# EAGLE design Main Board v3 Quad MD (EAGLE 9.6.2)

## Sheet 1 of 2: High Power
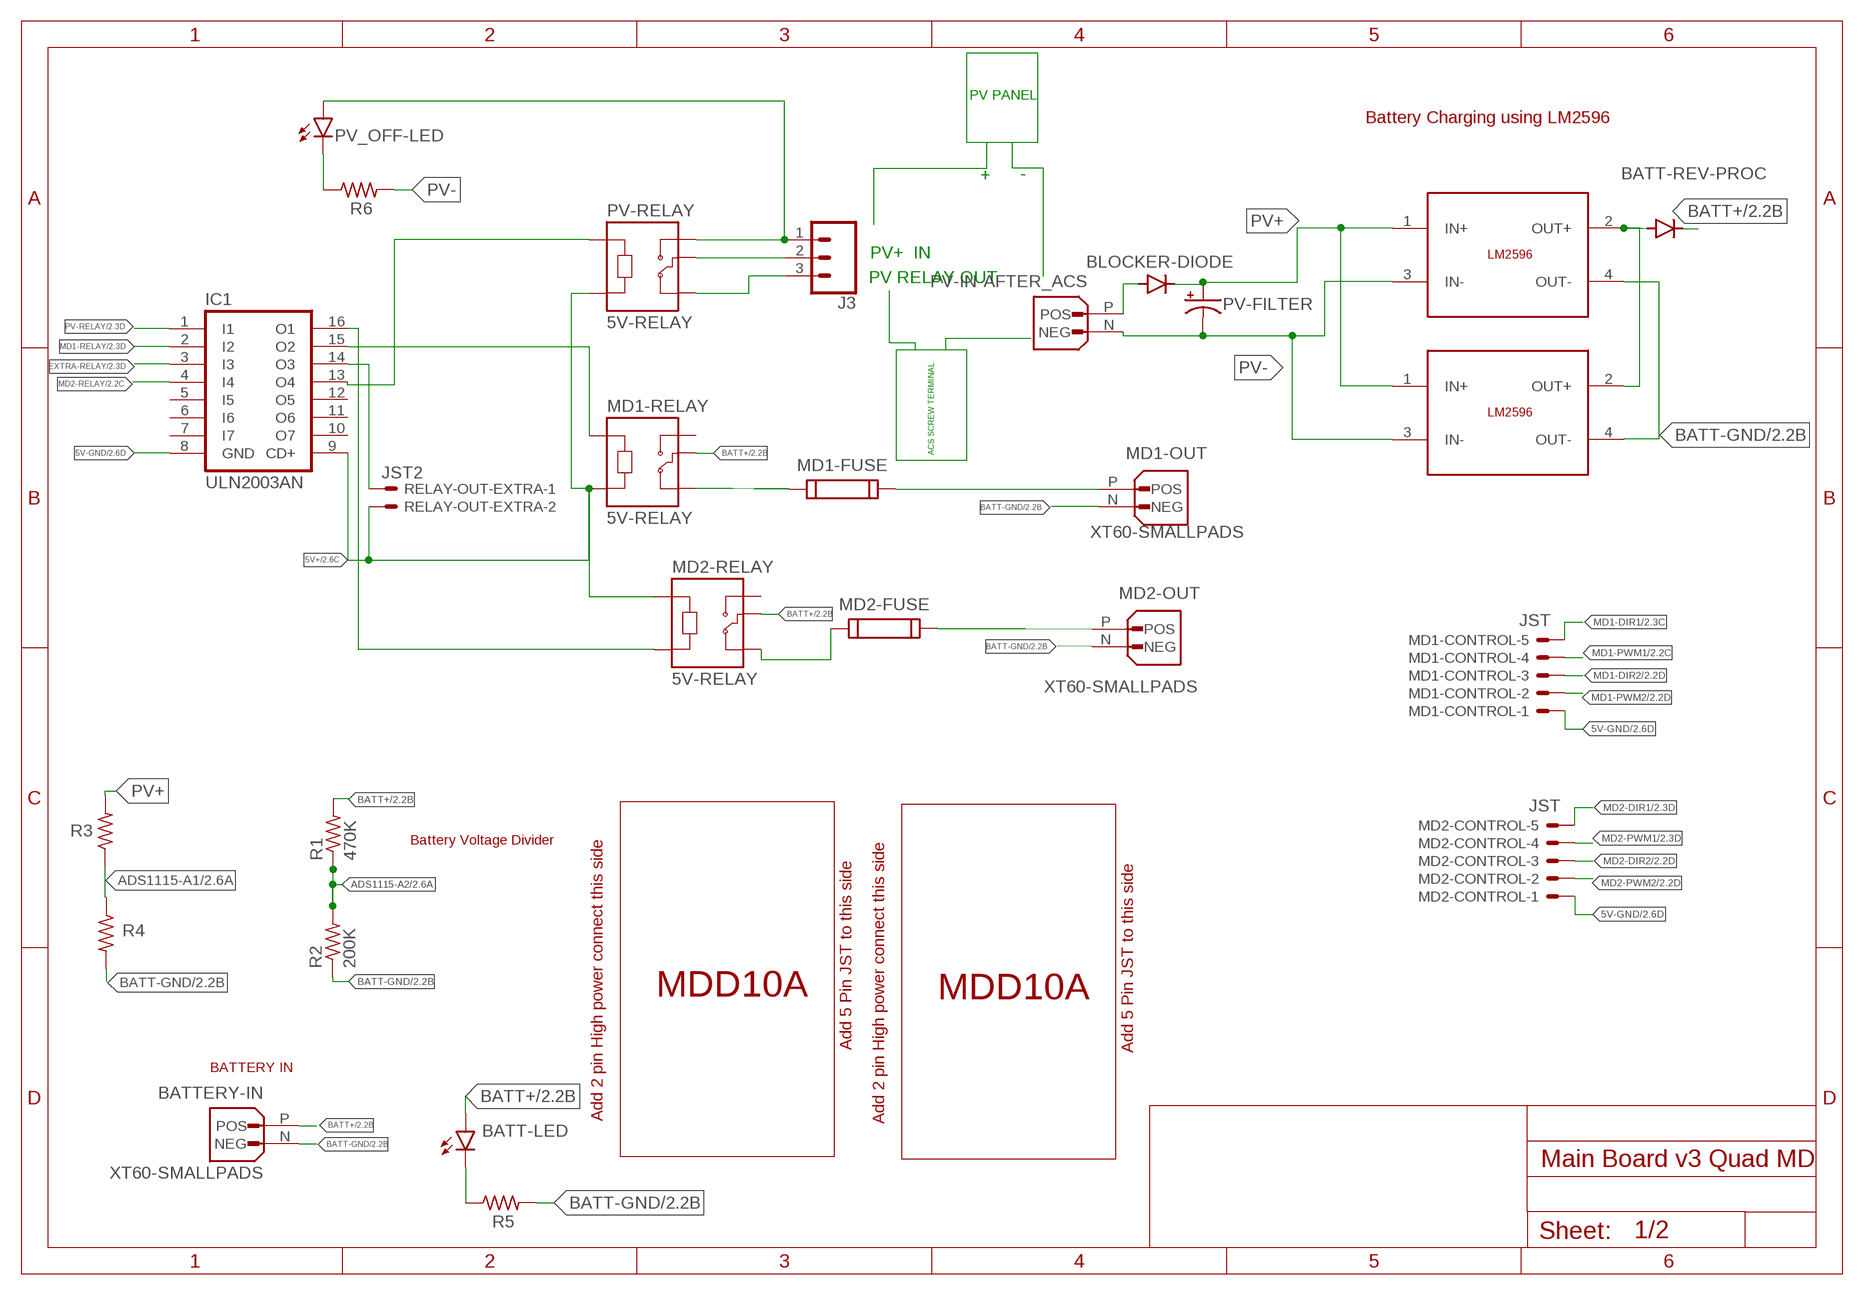
[diagram p0: schematic, sheet 1]

### Parts
BATT-LED  SFH482  [SFH482]
BATT-REV-PROC  1N5400  [DO201-15]
BATTERY-IN  XT60-SMALLPADS  [XT-60-SMALLPADS]
BLOCKER-DIODE  1N5400  [DO201-15]
IC1  ULN2003AN  [DIL16]
J3  CONN_03SCREW_LOCK  [SCREWTERMINAL-3.5MM-3_LOCK.007S]
MD1-CONTROL  JST  JST-XH-05-PIN-LONG-PAD  [JST-XH-05-PACKAGE-LONG-PAD]
MD1-FUSE  696101000002  [696101000002]
MD1-OUT  XT60-SMALLPADS  [XT-60-SMALLPADS]
MD1-RELAY  5V-RELAY  [RELAY-SRD-05VDC-SL-C]
MD2-CONTROL  JST  JST-XH-05-PIN-LONG-PAD  [JST-XH-05-PACKAGE-LONG-PAD]
MD2-FUSE  696101000002  [696101000002]
MD2-OUT  XT60-SMALLPADS  [XT-60-SMALLPADS]
MD2-RELAY  5V-RELAY  [RELAY-SRD-05VDC-SL-C]
PV-FILTER  CPOL-USE5-6  [E5-6]
PV-IN-AFTER_ACS  XT60-SMALLPADS  [XT-60-SMALLPADS]
PV-RELAY  5V-RELAY  [RELAY-SRD-05VDC-SL-C]
PV_OFF-LED  SFH482  [SFH482]
R1  470K  R-US_0309/12  [0309/12]
R2  200K  R-US_0309/12  [0309/12]
R3  R-US_0309/12  [0309/12]
R4  R-US_0309/12  [0309/12]
R5  R-US_0309/12  [0309/12]
R6  R-US_0309/12  [0309/12]
RELAY-OUT-EXTRA  JST2  JST-XH-02-PIN-LONG-PAD  [JST-XH-02-PACKAGE-LONG-PAD]
U$1  LM2596-MODULE  [LM2596-MODULE]
U$2  LM2596-MODULE  [LM2596-MODULE]
U$3  MDD10A-MODULE  [MDD10A]
U$7  MDD10A-MODULE  [MDD10A]

### Nets
5V+: IC1.9(CD+) MD1-RELAY.A2 MD2-RELAY.A1 PV-RELAY.A2 RELAY-OUT-EXTRA.2 ; also sheet 2
5V-GND: IC1.8(GND) MD1-CONTROL.1 MD2-CONTROL.1 ; also sheet 2
ADS1115-A1: R3.1 R4.1 ; also sheet 2
ADS1115-A2: R1.1 R2.2 ; also sheet 2
BATT+: BATT-LED.A BATT-REV-PROC.C BATTERY-IN.P(POS) MD1-RELAY.COM MD2-RELAY.COM R1.2 ; also sheet 2
BATT-GND: BATTERY-IN.N(NEG) MD1-OUT.N(NEG) MD2-OUT.N(NEG) R2.1 R4.2 R5.2 U$1.4(OUT-) U$2.4(OUT-) ; also sheet 2
EXTRA-RELAY: IC1.3(I3) ; also sheet 2
MD1-DIR1: MD1-CONTROL.5 ; also sheet 2
MD1-DIR2: MD1-CONTROL.3 ; also sheet 2
MD1-PWM1: MD1-CONTROL.4 ; also sheet 2
MD1-PWM2: MD1-CONTROL.2 ; also sheet 2
MD1-RELAY: IC1.2(I2) ; also sheet 2
MD2-DIR1: MD2-CONTROL.5 ; also sheet 2
MD2-DIR2: MD2-CONTROL.3 ; also sheet 2
MD2-PWM1: MD2-CONTROL.4 ; also sheet 2
MD2-PWM2: MD2-CONTROL.2 ; also sheet 2
MD2-RELAY: IC1.4(I4) ; also sheet 2
N$1: MD1-FUSE.2 MD1-OUT.P(POS)
N$2: IC1.14(O3) RELAY-OUT-EXTRA.1
N$3: J3.1 PV-RELAY.NO PV_OFF-LED.A
N$4: J3.2 PV-RELAY.COM
N$5: MD1-FUSE.1 MD1-RELAY.NC
N$6: MD2-FUSE.1 MD2-RELAY.NC
N$13: BLOCKER-DIODE.A PV-IN-AFTER_ACS.P(POS)
N$14: IC1.16(O1) MD2-RELAY.A2
N$15: MD2-FUSE.2 MD2-OUT.P(POS)
N$16: BATT-REV-PROC.A U$1.2(OUT+) U$2.2(OUT+)
N$17: IC1.13(O4) PV-RELAY.A1
N$18: BATT-LED.K(C) R5.1
N$19: PV_OFF-LED.K(C) R6.1
N$23: J3.3 PV-RELAY.NC
N$85: IC1.15(O2) MD1-RELAY.A1
PV+: BLOCKER-DIODE.C PV-FILTER.+ R3.2 U$1.1(IN+) U$2.1(IN+)
PV-: PV-FILTER.- PV-IN-AFTER_ACS.N(NEG) R6.2 U$1.3(IN-) U$2.3(IN-)
PV-RELAY: IC1.1(I1) ; also sheet 2
Unconnected: IC1.5(I5) IC1.6(I6) IC1.7(I7) IC1.10(O7) IC1.11(O6) IC1.12(O5) MD1-RELAY.NO MD2-RELAY.NO

### Notes on the sheet
- PV PANEL
- Battery Charging using LM2596
- + | -
- PV+  IN
- PV RELAY OUT
- ACS SCREW TERMINAL
- Battery Voltage Divider
- BATTERY IN

## Sheet 2 of 2: Embedded Systems
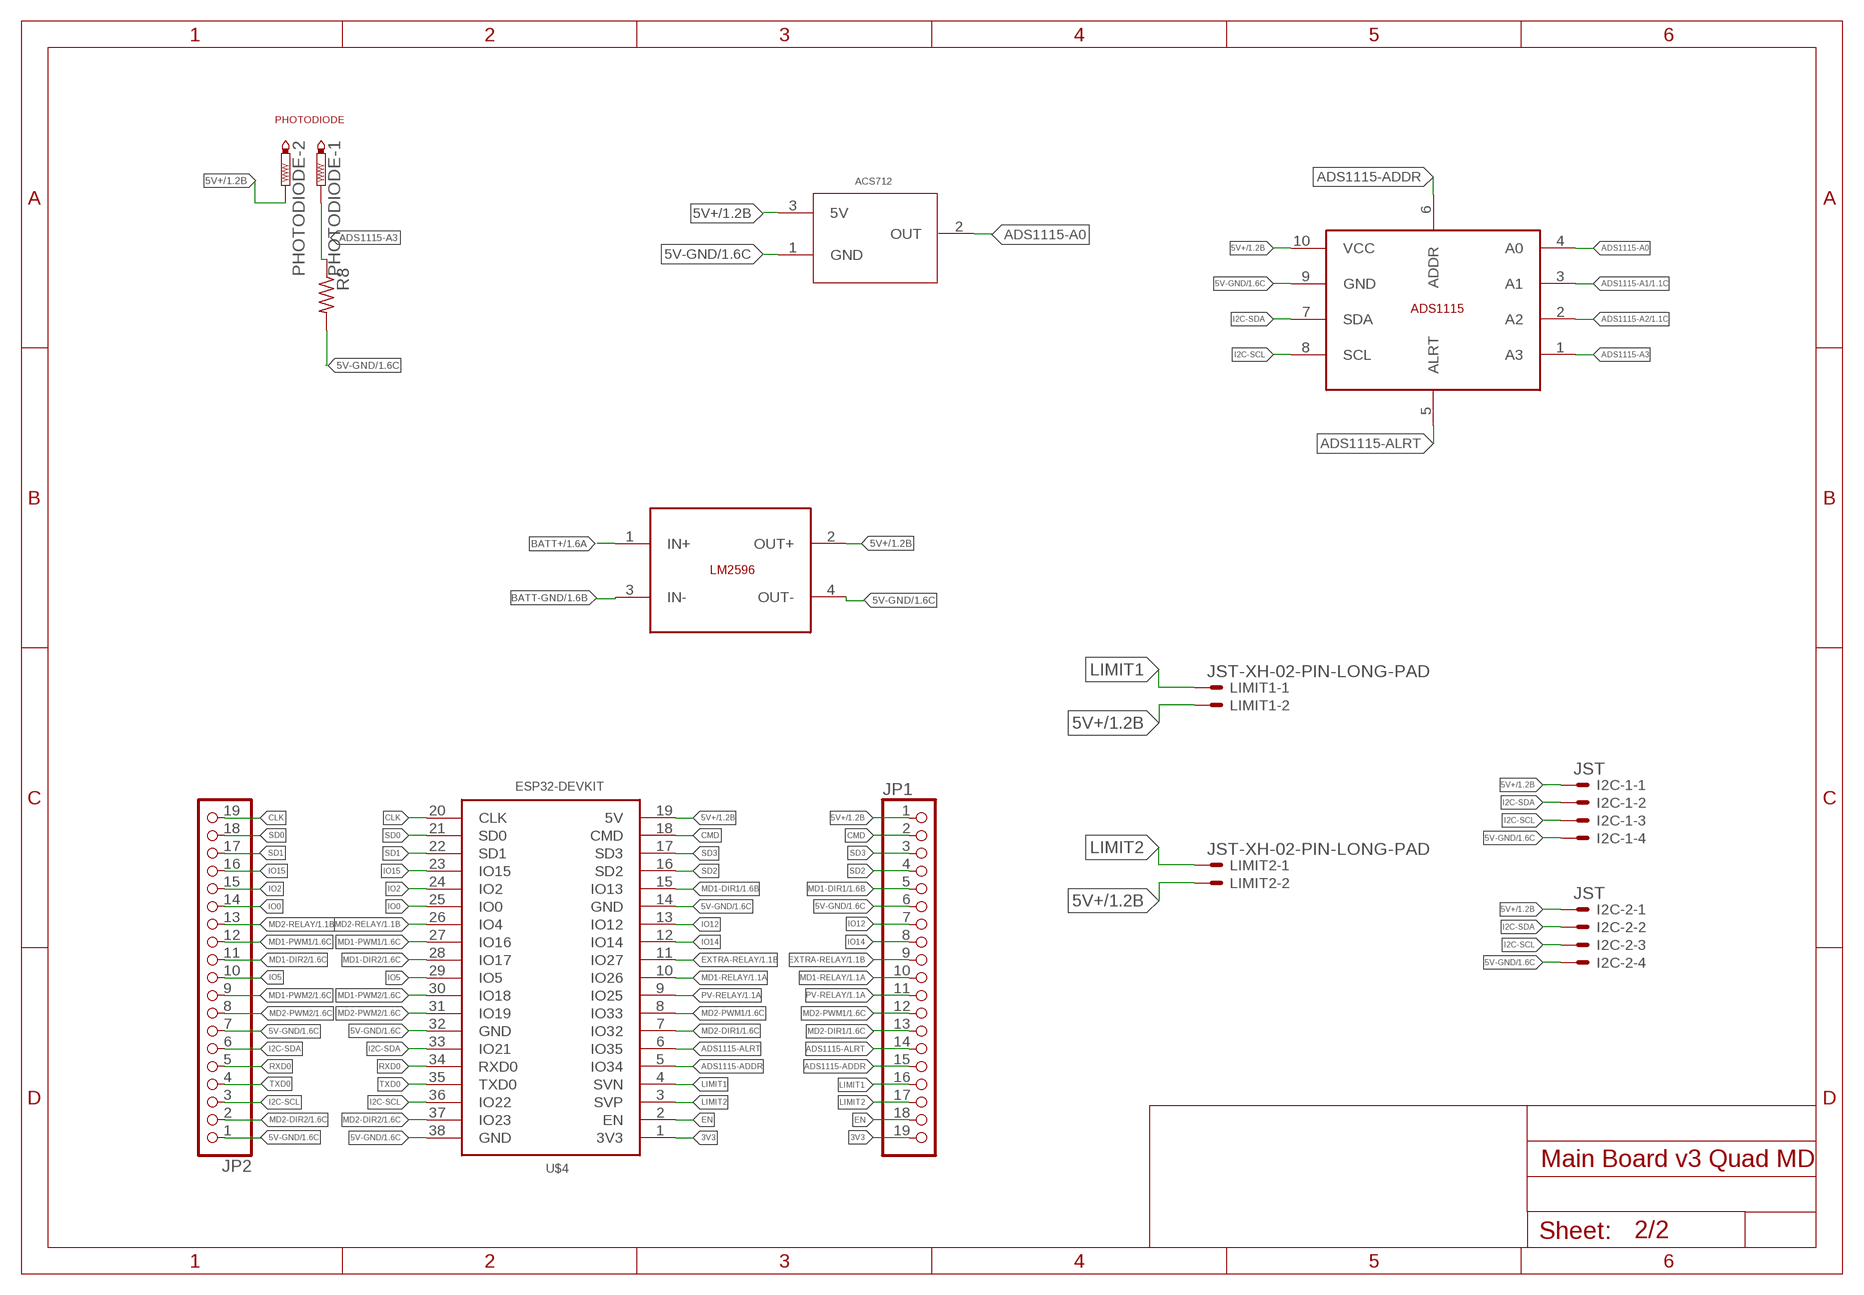
[diagram p1: schematic, sheet 2]

### Parts
I2C-1  JST  JST-XH-04-PIN-LONG-PAD  [JST-XH-04-PACKAGE-LONG-PAD]
I2C-2  JST  JST-XH-04-PIN-LONG-PAD  [JST-XH-04-PACKAGE-LONG-PAD]
JP1  PINHD-1X19  [1X19]
JP2  PINHD-1X19  [1X19]
LIMIT1  JST-XH-02-PIN-LONG-PAD  [JST-XH-02-PACKAGE-LONG-PAD]
LIMIT2  JST-XH-02-PIN-LONG-PAD  [JST-XH-02-PACKAGE-LONG-PAD]
PHOTODIODE  PTR2  [P2-38-17]
R8  R-US_0309/12  [0309/12]
U$4  ESP32-DEVKIT  [ESP32-38PINS]
U$5  ACS712-MODULE  [ACS712-MODULE]
U$6  ADS1115-MODULE  [ADS1115-MODULE]
U$8  LM2596-MODULE  [LM2596-MODULE]

### Nets
3V3: JP1.19 U$4.1(3V3)
5V+: I2C-1.1 I2C-2.1 JP1.1 LIMIT1.2 LIMIT2.2 PHOTODIODE.TP-2 U$4.19(5V) U$5.3(5V) U$6.10(VCC) U$8.2(OUT+) ; also sheet 1
5V-GND: I2C-1.4 I2C-2.4 JP1.6 JP2.1 JP2.7 R8.2 U$4.14(GND) U$4.32(GND) U$4.38(GND) U$5.1(GND) U$6.9(GND) U$8.4(OUT-) ; also sheet 1
ADS1115-A0: U$5.2(OUT) U$6.4(A0)
ADS1115-A1: U$6.3(A1) ; also sheet 1
ADS1115-A2: U$6.2(A2) ; also sheet 1
ADS1115-A3: PHOTODIODE.TP-1 R8.1 U$6.1(A3)
ADS1115-ADDR: JP1.15 U$4.5(IO34) U$6.6(ADDR)
ADS1115-ALRT: JP1.14 U$4.6(IO35) U$6.5(ALRT)
BATT+: U$8.1(IN+) ; also sheet 1
BATT-GND: U$8.3(IN-) ; also sheet 1
CLK: JP2.19 U$4.20(CLK)
CMD: JP1.2 U$4.18(CMD)
EN: JP1.18 U$4.2(EN)
EXTRA-RELAY: JP1.9 U$4.11(IO27) ; also sheet 1
I2C-SCL: I2C-1.3 I2C-2.3 JP2.3 U$4.36(IO22) U$6.8(SCL)
I2C-SDA: I2C-1.2 I2C-2.2 JP2.6 U$4.33(IO21) U$6.7(SDA)
IO0: JP2.14 U$4.25(IO0)
IO2: JP2.15 U$4.24(IO2)
IO5: JP2.10 U$4.29(IO5)
IO12: JP1.7 U$4.13(IO12)
IO14: JP1.8 U$4.12(IO14)
IO15: JP2.16 U$4.23(IO15)
LIMIT1: JP1.16 LIMIT1.1 U$4.4(SVN)
LIMIT2: JP1.17 LIMIT2.1 U$4.3(SVP)
MD1-DIR1: JP1.5 U$4.15(IO13) ; also sheet 1
MD1-DIR2: JP2.11 U$4.28(IO17) ; also sheet 1
MD1-PWM1: JP2.12 U$4.27(IO16) ; also sheet 1
MD1-PWM2: JP2.9 U$4.30(IO18) ; also sheet 1
MD1-RELAY: JP1.10 U$4.10(IO26) ; also sheet 1
MD2-DIR1: JP1.13 U$4.7(IO32) ; also sheet 1
MD2-DIR2: JP2.2 U$4.37(IO23) ; also sheet 1
MD2-PWM1: JP1.12 U$4.8(IO33) ; also sheet 1
MD2-PWM2: JP2.8 U$4.31(IO19) ; also sheet 1
MD2-RELAY: JP2.13 U$4.26(IO4) ; also sheet 1
PV-RELAY: JP1.11 U$4.9(IO25) ; also sheet 1
RXD0: JP2.5 U$4.34(RXD0)
SD0: JP2.18 U$4.21(SD0)
SD1: JP2.17 U$4.22(SD1)
SD2: JP1.4 U$4.16(SD2)
SD3: JP1.3 U$4.17(SD3)
TXD0: JP2.4 U$4.35(TXD0)

### Notes on the sheet
- PHOTODIODE

## Library data of the parts
BATT-LED PV_OFF-LED = led:SFH482: IR LED infrared emitting diode, Infineon
BATT-REV-PROC BLOCKER-DIODE = diode:1N5400: DIODE standard rectifier, 3 A, 50 V (Motorola)
BATTERY-IN MD1-OUT MD2-OUT PV-IN-AFTER_ACS = XT60-M:XT60-SMALLPADS
I2C-1 I2C-2 = JST XH Connectors:JST-XH-04-PIN: JST XH Connector 2 Pin Wire to board connector. Pitch: 2,54 mm, (0.100") Number of pins: 4
IC1 = ULN2003A:ULN2003A: Darlington Array Check availability <https://pricing.snapeda.com/parts/ULN2003A/STMicroelectronics/view-part?ref=eda>; AVAILABILITY: In Stock; DESCRIPTION: DARLINGTON ARRAY 7NPN, 2003, DIP16; Transistor Polarity:NPN; Collector Emitter Voltage V(br)ceo:50V; DC Collector Current:500mA; DC Current Gain hFE:1000; Operating Temperature Range:-20°C to +85°C; Transistor Case Style:DIP; No. of Pins:16; SVHC:No SVHC (20-Jun-2011); Base Number:2003; Current Ic Continuous a Max:500mA; Device Marking:ULN2003A; IC Generic Number:2003; Input Type:TTL, CMOS 5V; Input Voltage Max:5V; Logic Function Number:2003; Module Configuration:Seven; No. of Channels:7; No. of Transistors:7; Operating Temperature Max:85°C; Operating Temperature Min:-20°C; Output Current Max:500mA; Output Type:Open Collector; Output Voltage Max:50V; Package / Case:DIP; Termination Type:Through Hole; Transistor Type:Power Darlington; MF: STMicroelectronics; MP: ULN2003A; PACKAGE: DIP-16 Sprague; PRICE: None; PURCHASE-URL: https://pricing.snapeda.com/search/part/ULN2003A/?ref=eda; SPICEPREFIX: X
J3 = SparkFun-Connectors:CONN_03: Multi connection point. Often used as Generic Header-pin footprint for 0.1 inch spaced/style header connections On any of the 0.1 inch spaced packages, you can populate with these: Break Away Headers - Straight <https://www.sparkfun.com/products/116> (PRT-00116) Break Away Male Headers - Right Angle <https://www.sparkfun.com/products/553> (PRT-00553) Female Headers <https://www.sparkfun.com/products/115> (PRT-00115) Break Away Headers - Machine Pin <https://www.sparkfun.com/products/117> (PRT-00117) Break Away Female Headers - Swiss Machine Pin <https://www.sparkfun.com/products/743> (PRT-00743) Stackable Header - 3 Pin (Female, 0.1") <https://www.sparkfun.com/products/13875> (PRT-13875) For SCREWTERMINALS and SPRING TERMINALS visit here: Screw Terimnals on SparkFun.com <https://www.sparkfun.com/search/results?term=Screw+Terminals> (5mm/3.5mm/2.54mm spacing) This device is also useful as a general connection point to wire up your design to another part of your project. Our various solder wires solder well into these plated through hole pads. Hook-Up Wire - Assortment (Stranded, 22 AWG) <https://www.sparkfun.com/products/11375> (PRT-11375) Hook-Up Wire - Assortment (Solid Core, 22 AWG) <https://www.sparkfun.com/products/11367> (PRT-11367) View the entire wire category on our website here <https://www.sparkfun.com/categories/141> Special notes: Molex polarized connector foot print use with SKU : PRT-08232 with associated crimp pins and housings.; PROD_ID: CONN-08288; SF_ID: PRT-08235
JP1 JP2 = pinhead:PINHD-1X19: PIN HEADER
LIMIT1 LIMIT2 RELAY-OUT-EXTRA = JST XH Connectors:JST-XH-02-PIN: JST XH Connector 2 Pin Wire to board connector. Pitch: 2,54 mm, (0.100") Number of pins: 2
MD1-CONTROL MD2-CONTROL = JST XH Connectors:JST-XH-05-PIN: JST XH Connector 2 Pin Wire to board connector. Pitch: 2,54 mm, (0.100") Number of pins: 5
MD1-FUSE MD2-FUSE = Wurth_Connectors_WR-FSH:696101000002: WR-FSH Fuseholder THT Blocks PCB Clip Cover MATERIAL PROPERTIES Insulator Material PPO (PPE+PS) Insulator Flammability Rating UL94 V-1 Insulator Color Beige Contact Material Copper Alloy Contact Plating Tin over Nickel Contact Type Stamped GENERAL INFORMATION Operating Temperature -30 up to +120 °C Compliance RoHS ELECTRICAL PROPERTIES IR UL 18 A IR VDE 6.3 A Working Voltage [UL] 250 V (AC) Working Voltage [VDE] 250 V (AC) Withstanding Voltage [UL] 1500 V (AC) Withstanding Voltage [VDE] 1500 V (AC) Contact Resistance 10 mΩ MECHANICAL PROPERTIES Protection Class I & II Fuse Size 5x20 mm CERTIFICATION cULus Approval E157417 VDE Approval 129300 PACKAGING PROPERTIES Packaging Box <https://katalog.we-online.com/media/images/v2/o33101v209%20Family_WR-FSH_696101000002.jpg> Details see: https://katalog.we-online.com/en/em/FSH_THT_PCB_CLIP_COVER_696101000002 Updated by Ella Wu 2019-10-25 2019 (C) Wurth Elektronik; DATASHEET-URL: https://www.we-online.com/catalog/datasheet/696101000002.pdf; IR-UL: 18A; IR-VDE: 6.3A; MATES: 696120004001; PART-NUMBER: 696101000002; VALUE: 696101000002
MD1-RELAY MD2-RELAY PV-RELAY = 5V Relay:5V-RELAY: SRD-05VDC-SL-C 5V Trigger Relay Module For Arduino And Raspberry Pi 5V Trigger Relay Module For Arduino And Raspberry Pi Check availability <https://pricing.snapeda.com/parts/SRD-05VDC-SL-C/Songle%20Relay/view-part?ref=eda> Dimensions : 19.1x15.1x15.3 mm (LxWxH); AVAILABILITY: Not in stock; DESCRIPTION: 5V Trigger Relay Module For Arduino And Raspberry Pi 5V Trigger Relay Module For Arduino And Raspberry Pi; MF: Songle Relay; MP: SRD-05VDC-SL-C; PACKAGE: NON STANDARD-5 Songle Relay; PRICE: None
PHOTODIODE = testpad:PTR2: TEST PIN
PV-FILTER = rcl:CPOL-US: POLARIZED CAPACITOR, American symbol; SPICEPREFIX: C
R1-R6 R8 = rcl:R-US_: RESISTOR, American symbol; SPICEPREFIX: R
U$1 U$2 U$8 = LM2596 Module:LM2596-MODULE
U$3 U$7 = MDD10A Module:MDD10A-MODULE: This device is to place a MDD10A module on the top/bottom of the PCB using standoff's. You are supposed to have JST/Equivalent connector to connect the MD to the PCB. Similarly you have to have a 2 large pads on the other side to power the MD.
U$4 = ESP32 Devkit:ESP32-DEVKIT: ESP32 Devkit 38 GPIO Pins Specifications: Single or Dual-Core 32-bit LX6 Microprocessor with clock frequency up to 240 MHz. 520 KB of SRAM, 448 KB of ROM and 16 KB of RTC SRAM. Supports 802.11 b/g/n Wi-Fi connectivity with speeds up to 150 Mbps. Support for both Classic Bluetooth v4.2 and BLE specifications. 34 Programmable GPIOs. Up to 18 channels of 12-bit SAR ADC and 2 channels of 8-bit DAC. Serial Connectivity include 4 x SPI, 2 x I2C, 2 x I2S, 3 x UART. Ethernet MAC for physical LAN Communication (requires external PHY). 1 Host controller for SD/SDIO/MMC and 1 Slave controller for SDIO/SPI. Motor PWM and up to 16-channels of LED PWM. Secure Boot and Flash Encryption. Cryptographic Hardware Acceleration for AES, Hash (SHA-2), RSA, ECC and RNG.
U$5 = ACS712 Module:ACS712-MODULE
U$6 = ADS1115 MODULE:ADS1115-MODULE

## Board
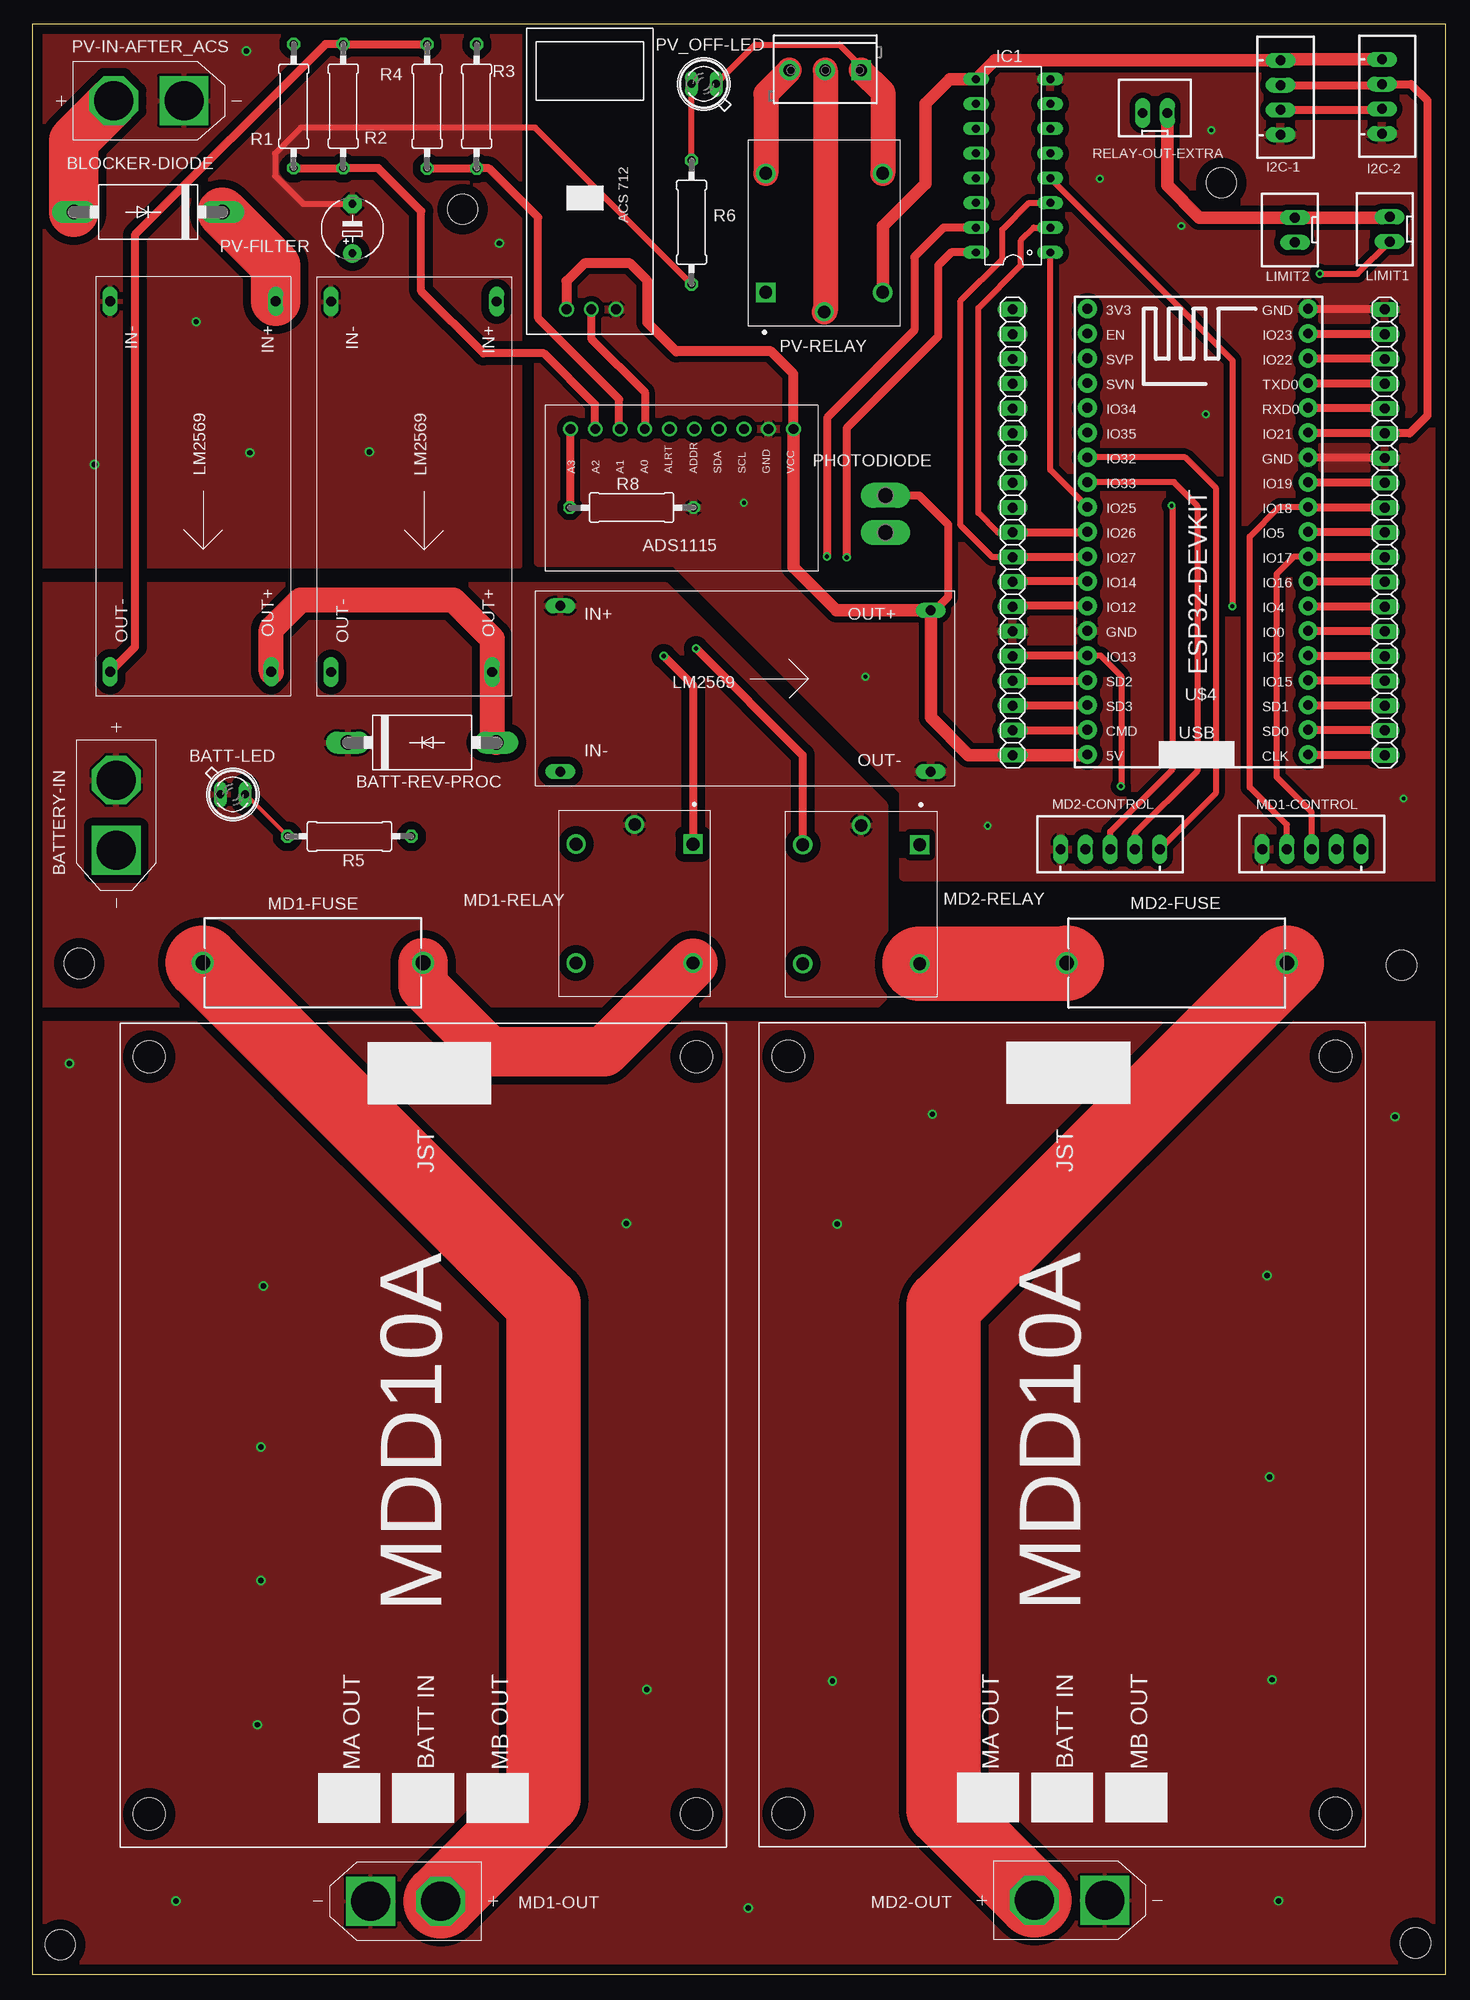
[diagram p2: board, top side]
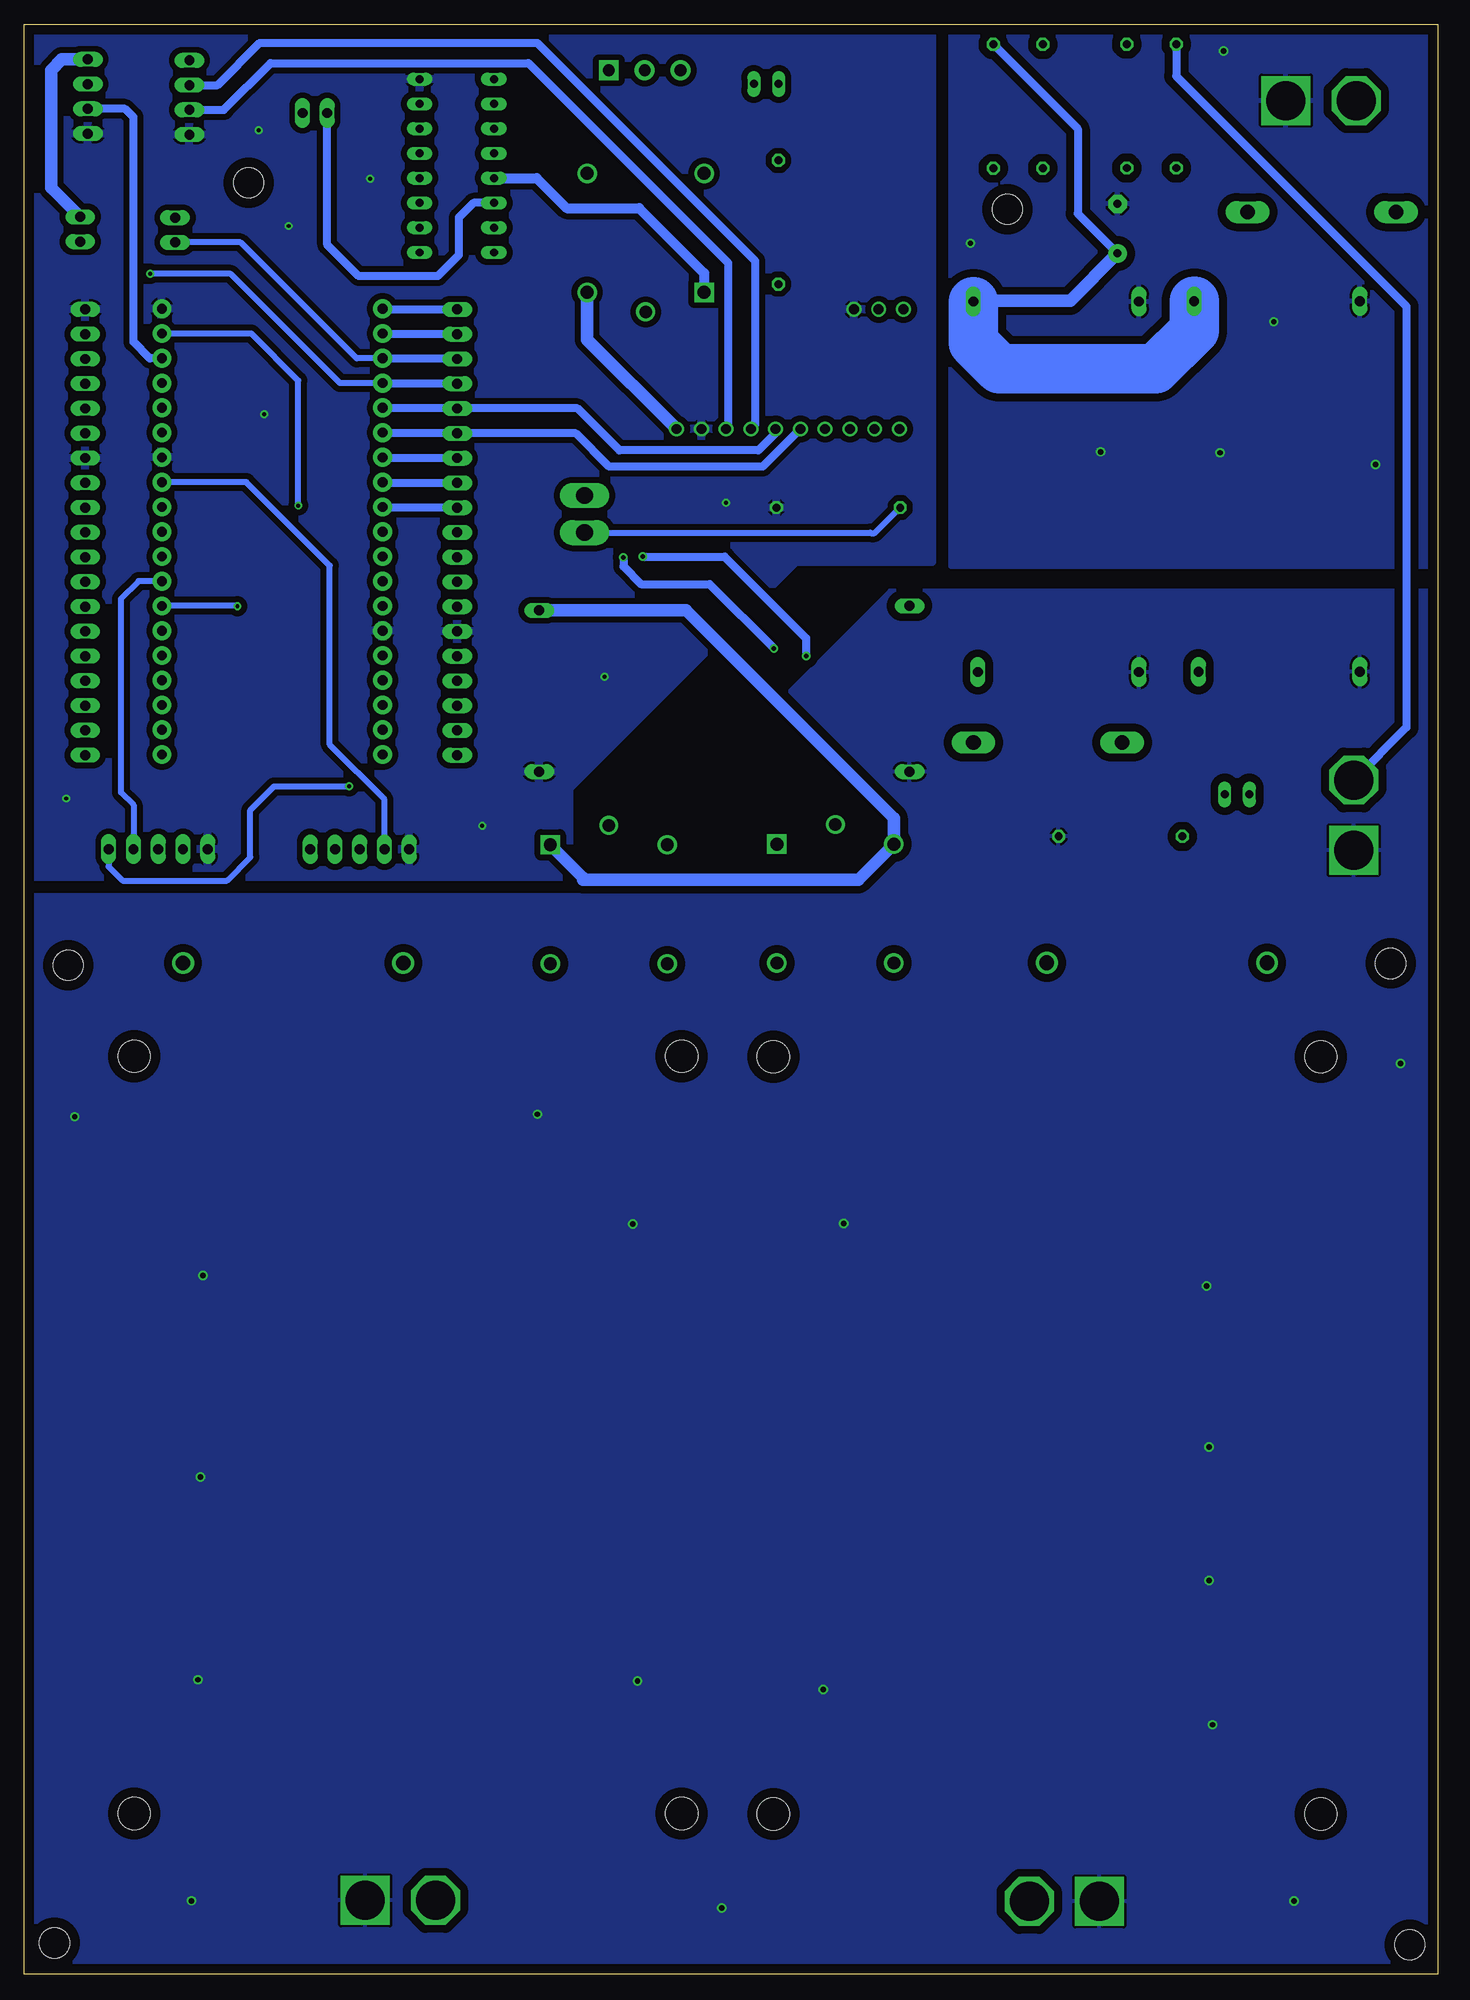
[diagram p3: board, bottom side, seen from below]

Size 145 x 200 mm. Coordinates in mm from the lower left corner, seen from the top.
Outline: 0,0 145,0 145,200 0,200 0,0
Copper layers (1*16): Top 0.035mm / dielectric 1.5mm / Bottom 0.035mm
Design rules "default": minimum track width 6mil, minimum drill 0.35mm, track to track 6mil, track to pad 6mil, pad to pad 6mil, via to via 6mil, smd to smd 6mil, copper to edge 40mil, drill to drill 6mil, minimum pad ring 10mil, minimum via ring 8mil, stop-mask expansion 4mil, vias tented up to drill 0mil, thermal gap 10mil
Holes 3.1 mm at 141.91,3.23 2.87,3.05 4.83,103.68 140.49,103.5 122,183.77 44.15,181.03

### Footprints (pad centres in the part's own frame; a part is rotated, then mirrored left to right if it is on the bottom)
SFH482 = drill 0.813 long: A -1.27,0; K 1.27,0
DO201-15 = drill 1.499 long: A 7.62,0; C -7.62,0
XT-60-SMALLPADS = drill 4 pad 5 square: N 3.6,0 | drill 4 pad 5 octagon: P -3.6,0
JST-XH-04-PACKAGE-LONG-PAD = drill 1.016 long: 1 -3.81,0; 2 -1.27,0; 3 1.27,0; 4 3.81,0
DIL16 = drill 0.813 long: 1 -8.89,-3.81; 2 -6.35,-3.81; 3 -3.81,-3.81; 4 -1.27,-3.81; 5 1.27,-3.81; 6 3.81,-3.81; 7 6.35,-3.81; 8 8.89,-3.81; 9 8.89,3.81; 10 6.35,3.81; 11 3.81,3.81; 12 1.27,3.81; 13 -1.27,3.81; 14 -3.81,3.81; 15 -6.35,3.81; 16 -8.89,3.81
SCREWTERMINAL-3.5MM-3_LOCK.007S = drill 1.2 pad 2.032 square: 1 -0.178,0 | drill 1.2 pad 2.032: 2 3.5,0; 3 7.178,0
1X19 = drill 1.016 long: 1 -22.86,0; 2 -20.32,0; 3 -17.78,0; 4 -15.24,0; 5 -12.7,0; 6 -10.16,0; 7 -7.62,0; 8 -5.08,0; 9 -2.54,0; 10 0,0; 11 2.54,0; 12 5.08,0; 13 7.62,0; 14 10.16,0; 15 12.7,0; 16 15.24,0; 17 17.78,0; 18 20.32,0; 19 22.86,0
JST-XH-02-PACKAGE-LONG-PAD = drill 1.016 long: 1 -1.27,0; 2 1.27,0
JST-XH-05-PACKAGE-LONG-PAD = drill 1.016 long: 1 -5.08,0; 2 -2.54,0; 3 0,0; 4 2.54,0; 5 5.08,0
696101000002 = drill 1.5: 1 -11.3,0; 2 11.3,0
RELAY-SRD-05VDC-SL-C = drill 1.32 square: A1 -6.1,6 | drill 1.32: A2 -6.1,-6; NC 6.1,6; NO 6.1,-6 | drill 1.29: COM -8.1,0
P2-38-17 = drill 1.702 pad 2.121 long: TP-1 -1.905,0; TP-2 1.905,0
E5-6 = drill 0.813 pad 1.905: + -2.54,0 | drill 0.813 pad 1.905 octagon: - 2.54,0
0309/12 = drill 0.813 octagon: 1 -6.35,0; 2 6.35,0
LM2596-MODULE = drill 1.016 long: 1 2.54,18.46; 2 40.54,18; 3 2.54,1.46; 4 40.54,1.46
MDD10A = hole 3.3: 81.09,3.06; 3.42,3.06; 3.42,59.22; 81.09,59.22
ESP32-38PINS = drill 1 pad 1.93: 1 1.408,47.131; 2 1.408,44.591; 3 1.408,42.051; 4 1.408,39.511; 5 1.408,36.971; 6 1.408,34.431; 7 1.408,31.891; 8 1.408,29.351; 9 1.408,26.811; 10 1.408,24.271; 11 1.408,21.731; 12 1.408,19.191; 13 1.408,16.651; 14 1.408,14.111; 15 1.408,11.571; 16 1.408,9.031; 17 1.408,6.491; 18 1.408,3.951; 19 1.408,1.411; 20 24.058,1.411; 21 24.058,3.951; 22 24.058,6.491; 23 24.058,9.031; 24 24.058,11.571; 25 24.058,14.111; 26 24.058,16.651; 27 24.058,19.191; 28 24.058,21.731; 29 24.058,24.271; 30 24.058,26.811; 31 24.058,29.351; 32 24.058,31.891; 33 24.058,34.431; 34 24.058,36.971; 35 24.058,39.511; 36 24.058,42.051; 37 24.058,44.591; 38 24.058,47.131
ACS712-MODULE = drill 1.016: 1 2.54,3.81; 2 2.54,6.35; 3 2.54,8.89
ADS1115-MODULE = drill 1.016: 1 2.43,2.62; 2 2.43,5.16; 3 2.43,7.7; 4 2.43,10.24; 5 2.43,12.78; 6 2.43,15.32; 7 2.43,17.86; 8 2.43,20.4; 9 2.43,22.94; 10 2.43,25.48

### Placement (x,y rotation side)
BATT-LED  20.57,121.03 0 top
BATT-REV-PROC  40.01,126.34 0 top
BATTERY-IN  8.61,118.9 270 top
BLOCKER-DIODE  11.89,180.75 180 top
I2C-1  128.07,192.51 270 top
I2C-2  138.48,192.61 270 top
IC1  100.63,185.5 90 top
J3  84.86,195.3 180 top
JP1  100.58,147.9 90 top
JP2  138.76,147.9 270 top
LIMIT1  139.27,178.99 90 top
LIMIT2  129.54,178.92 90 top
MD1-CONTROL  131.27,115.42 0 top
MD1-FUSE  28.8,103.76 180 top
MD1-OUT  38.3,7.49 180 top
MD1-RELAY  61.8,109.83 270 top
MD2-CONTROL  110.59,115.39 0 top
MD2-FUSE  117.42,103.73 0 top
MD2-OUT  106.43,7.59 0 top
MD2-RELAY  85.04,109.75 270 top
PHOTODIODE  87.53,149.78 90 top
PV-FILTER  32.84,179.04 90 top
PV-IN-AFTER_ACS  11.96,192.18 0 top
PV-RELAY  81.25,178.61 90 top
PV_OFF-LED  68.88,193.9 180 top
R1  26.82,191.62 90 top
R2  31.9,191.62 270 top
R3  45.59,191.59 90 top
R4  40.51,191.59 90 top
R5  32.54,116.71 0 top
R6  67.64,179.71 270 top
R8  61.49,150.44 0 top
RELAY-OUT-EXTRA  115.19,190.91 0 top
U$1  29.18,174.12 270 top
U$2  6.53,174.14 270 top
U$3  136.78,13.08 90 top
U$4  106.83,123.7 0 top
U$5  63.7,168.22 90 top
U$6  52.6,160.93 270 top
U$7  71.22,13.03 90 top
U$8  51.64,121.89 0 top

### Tracks (layer width: path | path; a pad name or v marks a point on that pad's centre or on a via)
3V3
  Bottom 0.813: U$4.1 108.18,170.76 JP1.19
5V+
  Top 0.813: PHOTODIODE.TP-2 90.98,151.69 93.95,148.72 93.95,141.25 92.6,139.9 U$8.2
  Top 1.016: U$6.10 78.08,164.16 75.77,166.47 66.06,166.47 63.12,169.42 63.12,173.69 61.32,175.49 56.64,175.49 54.81,173.66 U$5.3
  Top 1.27: U$4.19 108.18,125.04 JP1.1 96.06,125.04 92.18,128.93 U$8.2 82.51,139.9 78.08,144.32 U$6.10 | PV-RELAY.A2 87.25,179.28 91.64,183.67 91.64,191.87 94.16,194.39 IC1.9 98.75,196.32 I2C-1.1 128.17,196.42 I2C-2.1 | LIMIT1.2 139.19,180.19 LIMIT2.2 119.76,180.19 116.46,183.49 RELAY-OUT-EXTRA.2
  Bottom 1.27: MD2-RELAY.A1 87.66,112.47 87.66,112.3 87.66,112.29 59.43,112.29 MD1-RELAY.A2 55.8,118.6 77.1,139.9 U$8.2 | U$6.10 87.25,167.68 PV-RELAY.A2 | I2C-2.1 141.15,196.42 142.26,195.3 142.26,183.26 LIMIT1.2
5V-GND  (via drill 0.4)
  Top 0.813: U$4.32 138.7,155.59 JP2.7 | U$4.38 138.7,170.83 JP2.1
  other vias: 109.52,184.15 117.88,179.32 120.98,189.15 120.4,159.99 140.69,120.6 98.02,117.81 85.47,133.1 73,150.95
  pour Top (isolate 0.61): 51.84,201.24 51.84,144.79 65.87,144.79 89.33,121.34 89.33,112.55 145.52,112.55 145.92,112.15 145.92,201.24
  pour Bottom (isolate 0.61): 51.87,201.24 51.87,144.86 65.89,144.86 89.13,121.62 89.13,112.55 145.73,112.55 145.92,112.35 145.92,201.24
ADS1115-A0
  Top 0.813: U$5.2 57.35,167.77 62.84,162.28 U$6.4
ADS1115-A1
  Top 0.813: R4.1 R3.1 46.86,185.24 51.89,180.21 51.89,169.88 60.22,161.54 60.22,158.58 U$6.3
ADS1115-A2
  Top 0.813: R1.1 R2.2 35.48,185.27 39.9,180.85 39.9,172.64 46.28,166.27 52.5,166.27 57.76,161.01 U$6.2
ADS1115-A3
  Top 0.813: R8.1 55.22,150.52 U$6.1
  Bottom 0.61: PHOTODIODE.TP-1 58.22,147.88 58.17,147.83 57.76,147.83 R8.1
ADS1115-ADDR
  Bottom 0.813: U$6.6 67.92,158.07 69.68,156.31 83.96,156.31 88.25,160.6 JP1.15 100.65,160.67 U$4.5
ADS1115-ALRT
  Bottom 0.813: U$6.5 69.25,154.63 84.99,154.63 88.42,158.06 JP1.14 100.65,158.13 U$4.6
BATT+
  Bottom 0.813: R1.2 26.82,194.69 3.2,171.07 3.2,127.91 BATTERY-IN.P
  pour Top (isolate 0.813): -4.39,142.52 64.95,142.52 87.48,119.99 87.48,100.23 86.72,99.47 -3.66,99.47 -3.66,141.78
BATT-GND  (via drill 0.55)
  Top 0.813: U$2.4 10.52,136.13 10.52,178.41 30.07,197.97 R2.1 40.49,197.97 R4.2
  other vias: 60.93,77.01 63.04,29.24 92.35,88.21 82.09,30.1 127.2,30.23 23.09,25.6 14.73,7.52 127.86,7.54 73.46,6.81 82.58,76.96 3.81,93.42 23.44,40.41 139.83,87.96 126.7,71.68 126.95,51.03 23.44,54.1 23.7,70.61
  pour Bottom (isolate 0.813): 56.21,141.94 87.45,110.69 147.47,110.69 147.47,-1.07 147.88,-1.47 -2.74,-1.47 -3.68,-2.41 -3.68,141.94
  pour Top (isolate 0.813): -3.66,97.59 147.47,97.59 147.47,-1.07 147.88,-1.47 -2.74,-1.47 -3.66,-2.39
CLK
  Top 0.813: JP2.19 130.96,125.04 U$4.20
CMD
  Top 0.813: JP1.2 108.18,127.58 U$4.18
EN
  Bottom 0.813: U$4.2 100.65,168.29 JP1.18
EXTRA-RELAY
  Top 0.61: JP1.9 98.5,145.36 95.25,148.62 95.25,171.65 99.52,175.92 99.52,178.94 102.26,181.69 IC1.3
  Top 0.813: U$4.11 108.18,145.36 JP1.9
I2C-SCL
  Top 0.813: I2C-1.3 138.38,191.24 I2C-2.3 | U$4.36 138.7,165.75 JP2.3
  Bottom 0.813: I2C-1.3 124.54,191.24 119.74,196.04 93.29,196.04 72.8,175.54 72.8,158.71 U$6.8 | U$4.36 132.12,165.75 133.81,167.44 133.81,190.47 134.67,191.34 I2C-2.3
I2C-SDA
  Top 0.813: I2C-1.2 138.38,193.78 I2C-2.2 141.45,193.88 143.13,192.2 143.13,159.87 141.33,158.06 JP2.6 130.96,158.06 U$4.33
  Bottom 0.813: I2C-1.2 125.17,193.78 120.85,198.09 92.38,198.09 70.03,175.75 70.03,158.94 U$6.7
IO0
  Top 0.813: U$4.25 138.7,137.81 JP2.14
IO2
  Top 0.813: JP2.15 130.96,135.2 U$4.24
IO5
  Top 0.813: U$4.29 138.7,147.97 JP2.10
IO12
  Top 0.813: U$4.13 100.65,140.35 JP1.7
IO14
  Top 0.813: U$4.12 100.65,142.89 JP1.8
IO15
  Top 0.813: U$4.23 138.7,132.73 JP2.16
LIMIT1  (via drill 0.4)
  Top 0.61: v132.08,174.42 135.97,174.42 LIMIT1.1
  Bottom 0.61: U$4.4 112.61,163.21 123.83,174.42 v132.08,174.42
  Bottom 0.813: U$4.4 100.65,163.21 JP1.16
LIMIT2
  Bottom 0.61: U$4.3 110.91,165.75 122.81,177.65 LIMIT2.1
  Bottom 0.813: U$4.3 100.65,165.75 JP1.17
MD1-DIR1  (via drill 0.4)
  Top 0.61: v111.68,121.84 111.73,121.89 111.73,133.15 109.61,135.27 U$4.15
  Top 0.813: U$4.15 100.65,135.27 JP1.5
  Bottom 0.61: MD1-CONTROL.5 136.35,113.61 134.93,112.19 124.21,112.19 121.82,114.58 121.82,119.41 119.38,121.84 v111.68,121.84
MD1-DIR2
  Top 0.61: MD1-CONTROL.3 131.27,119.2 127.69,122.78 127.69,143.64 129.48,145.43 130.76,145.43 U$4.28
  Top 0.813: JP2.11 130.82,145.36 130.76,145.43
MD1-PWM1
  Top 0.813: U$4.27 138.7,142.89 JP2.12
  Bottom 0.61: U$4.27 133.28,142.89 135.1,141.07 135.1,121.23 133.81,119.94 MD1-CONTROL.4
MD1-PWM2
  Top 0.61: MD1-CONTROL.2 128.73,117.93 124.92,121.74 124.92,147.47 127.95,150.51 U$4.30
  Top 0.813: JP2.9 130.96,150.44 U$4.30
MD1-RELAY
  Top 0.61: JP1.10 99.03,147.9 97.05,149.88 97.05,170.89 101.45,175.28 101.45,177.85 102.74,179.15 IC1.2
  Top 0.813: JP1.10 108.18,147.9 U$4.10
MD2-DIR1
  Top 0.61: MD2-CONTROL.5 121.41,121.13 121.41,152.48 118.3,155.59 U$4.7
  Bottom 0.813: JP1.13 108.18,155.52 U$4.7
MD2-DIR2  (via drill 0.4)
  Top 0.61: MD2-CONTROL.3 110.59,117.2 116.97,123.57 116.97,150.57 v116.89,150.65
  Top 0.813: JP2.2 130.96,168.22 U$4.37
  Bottom 0.61: v116.89,150.65 116.89,163.47 121.7,168.29 U$4.37
MD2-PWM1
  Top 0.61: MD2-CONTROL.4 113.13,117.02 119.53,123.42 119.53,150.65 117.13,153.05 U$4.8
  Bottom 0.813: U$4.8 108.18,152.98 JP1.12
MD2-PWM2
  Top 0.813: JP2.8 130.96,152.98 U$4.31
  Bottom 0.61: MD2-CONTROL.2 108.05,120.52 113.67,126.14 113.67,144.47 122.24,153.05 U$4.31
MD2-RELAY  (via drill 0.4)
  Top 0.61: IC1.4 123.14,165.53 v123.14,140.31
  Top 0.813: JP2.13 130.96,140.28 U$4.26
  Bottom 0.61: v123.14,140.31 123.18,140.35 U$4.26
N$1
  Top 7.62: MD1-FUSE.2 52.48,68.79 52.48,18.07 MD1-OUT.P
N$2
  Bottom 0.813: IC1.14 98.93,181.69 100.43,180.19 100.43,176.33 102.59,174.17 110.69,174.17 113.92,177.39 RELAY-OUT-EXTRA.1
N$3
  Top 0.61: PV_OFF-LED.A 74.17,197.92 82.83,197.92 85.04,195.71 J3.1
  Top 2.54: J3.1 87.25,193.09 PV-RELAY.NO
N$4
  Top 2.54: J3.2 81.36,170.62 PV-RELAY.COM
N$5
  Top 5.08: MD1-RELAY.NC 58.68,94.61 46.89,94.61 40.1,101.4 MD1-FUSE.1
N$6
  Top 7.62: MD2-RELAY.NC 106.04,103.65 MD2-FUSE.1
N$13
  Top 5.08: PV-IN-AFTER_ACS.P 4.27,188.08 BLOCKER-DIODE.A
N$14  (via drill 0.45)
  Top 0.813: IC1.16 94.28,176.61 92.94,175.26 92.94,167.97 83.54,158.57 v83.54,145.34 | v68.1,135.99 79.04,125.05 MD2-RELAY.A2
  Bottom 0.813: v83.54,145.34 83.54,144.4 81.74,142.6 74.7,142.6 v68.1,135.99
N$15
  Top 7.62: MD2-FUSE.2 93.5,68.51 93.5,16.92 MD2-OUT.P
N$16
  Top 2.54: U$2.2 24.53,137.96 27.53,140.97 43.18,140.97 47.19,136.97 U$1.2 47.19,126.78 BATT-REV-PROC.A
N$17
  Bottom 1.016: IC1.13 92.43,184.23 89.36,181.15 81.91,181.15 75.25,174.49 PV-RELAY.A1
N$18
  Top 0.406: BATT-LED.K 21.87,121.03 R5.1
N$19
  Top 0.61: R6.1 67.64,193.88 PV_OFF-LED.K
N$23
  Top 2.54: J3.3 75.25,192.87 PV-RELAY.NC
N$85  (via drill 0.45)
  Top 0.813: IC1.15 93.5,179.15 90.5,176.15 90.5,168.6 81.53,159.64 v81.53,145.41 | v64.8,135.2 67.8,132.2 MD1-RELAY.A1
  Bottom 0.813: v81.53,145.41 73.15,145.41 64.8,137.06 v64.8,135.2
PV+
  Top 5.08: BLOCKER-DIODE.C 24.99,175.27 U$2.1
  Bottom 0.813: R3.2 36.93,189.28 36.93,180.59 PV-FILTER.+
  Bottom 1.27: PV-FILTER.+ 37.69,171.65 47.65,171.65 U$1.1
  Bottom 5.08: U$1.1 47.65,167.36 44.95,164.67 28.96,164.67 24.99,168.64 U$2.1
PV-  (via drill 0.55)
  Top 0.61: R6.2 51.59,189.41 27.58,189.41 24.92,186.74 24.92,184.46 27.79,181.59 PV-FILTER.-
  other vias: 22.33,156.06 34.57,156.16 47.93,177.55 21.97,197.26 6.38,154.86 16.81,169.49
  pour Bottom (isolate 0.813): 50.01,201.32 50.01,144.42 -0.61,144.42 -0.61,200.71 0,201.32
  pour Top (isolate 0.813): 50.01,201.32 50.01,144.42 0.23,144.42 -0.61,143.59 -0.61,200.71 0,201.32
PV-RELAY
  Top 0.61: U$4.9 104.44,154.31 IC1.1
  Bottom 0.813: JP1.11 108.18,150.44 U$4.9
RXD0
  Top 0.813: U$4.34 138.7,160.67 JP2.5
SD0
  Top 0.813: U$4.21 138.7,127.65 JP2.18
SD1
  Top 0.813: JP2.17 130.96,130.12 U$4.22
SD2
  Top 0.813: JP1.4 108.18,132.66 U$4.16
SD3
  Top 0.813: U$4.17 108.18,130.12 JP1.3
TXD0
  Top 0.813: JP2.4 130.96,163.14 U$4.35